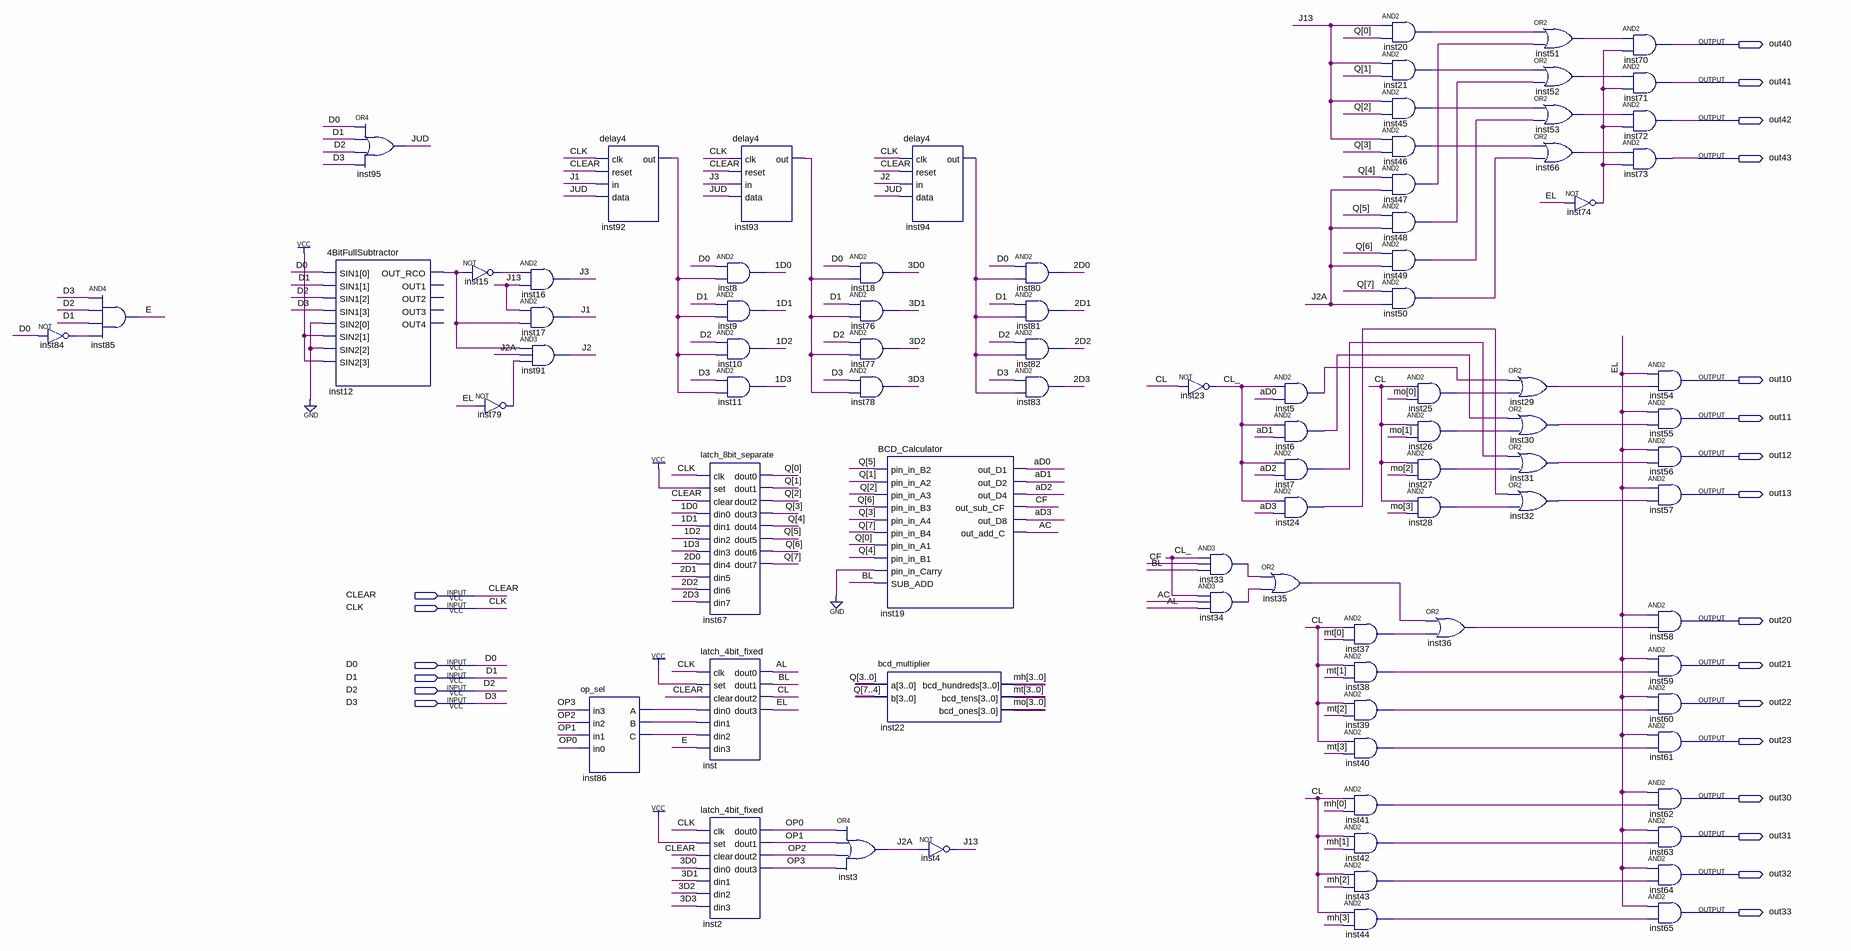
[diagram p0: schematic sheet]
// Quartus schematic Simulation_Circuit2.0.bdf as structural Verilog: 86 symbols, 22 pins
module \Simulation_Circuit2.0  (
  input  CLEAR,
  input  CLK,
  input  D0,
  input  D1,
  input  D2,
  input  D3,
  output out40,
  output out41,
  output out42,
  output out43,
  output out10,
  output out11,
  output out12,
  output out13,
  output out20,
  output out21,
  output out22,
  output out23,
  output out30,
  output out31,
  output out32,
  output out33
);

  wire \1D0 , \1D1 , \1D2 , \1D3 , \2D0 , \2D1 , \2D2 , \2D3 , \3D0 , \3D1 , \3D2 , \3D3 , AC, aD0, aD1, aD2,
       aD3, AL, BL, CF, CL, CL_, E, EL, inst5_out, inst6_out, inst7_out, inst12_out_rco, inst15_out,
       inst20_out, inst21_out, inst24_out, inst25_out, inst26_out, inst27_out, inst28_out, inst29_out,
       inst30_out, inst31_out, inst32_out, inst33_out, inst34_out, inst35_out, inst36_out, inst37_out,
       inst38_out, inst39_out, inst40_out, inst41_out, inst42_out, inst43_out, inst44_out, inst45_out,
       inst46_out, inst47_out, inst48_out, inst49_out, inst50_out, inst51_out, inst52_out, inst53_out,
       inst66_out, inst74_out, inst79_out, inst84_out, inst86_a, inst86_b, inst86_c, inst92_out, inst93_out,
       inst94_out, J1, J2, J2A, J3, J13, JUD, OP0, OP1, OP2, OP3;
  wire [3:0] mh, mo, mt;
  wire [7:0] Q;

  not inst84 (inst84_out, D0);
  and inst85 (E, D3, D2, D1, inst84_out);
  or inst95 (JUD, D0, D1, D2, D3);
  \4BitFullSubtractor  inst12 (
    .SIN1({D3, D2, D1, D0}), .SIN2(4'b1010), .OUT_RCO(inst12_out_rco));  // open: OUT1, OUT2, OUT3, OUT4
  not inst15 (inst15_out, inst12_out_rco);
  not inst79 (inst79_out, EL);
  and inst16 (J3, inst15_out, J13);
  and inst17 (J1, J13, inst12_out_rco);
  and inst91 (J2, inst12_out_rco, J2A, inst79_out);
  delay4 inst92 (.clk(CLK), .reset(CLEAR), .in(J1), .data(JUD), .out(inst92_out));
  op_sel inst86 (.in3(OP3), .in2(OP2), .in1(OP1), .in0(OP0), .A(inst86_a), .B(inst86_b), .C(inst86_c));
  and inst8 (\1D0 , D0, inst92_out);
  and inst9 (\1D1 , D1, inst92_out);
  and inst10 (\1D2 , D2, inst92_out);
  and inst11 (\1D3 , D3, inst92_out);
  latch_8bit_separate inst67 (
    .clk(CLK), .set(1'b1), .clear(CLEAR), .din0(\1D0 ), .din1(\1D1 ), .din2(\1D2 ), .din3(\1D3 ),
    .din4(\2D0 ), .din5(\2D1 ), .din6(\2D2 ), .din7(\2D3 ), .dout0(Q[0]), .dout1(Q[1]), .dout2(Q[2]),
    .dout3(Q[3]), .dout4(Q[4]), .dout5(Q[5]), .dout6(Q[6]), .dout7(Q[7]));
  latch_4bit_fixed inst (
    .clk(CLK), .set(1'b1), .clear(CLEAR), .din0(inst86_a), .din1(inst86_b), .din2(inst86_c), .din3(E),
    .dout0(AL), .dout1(BL), .dout2(CL), .dout3(EL));
  latch_4bit_fixed inst2 (
    .clk(CLK), .set(1'b1), .clear(CLEAR), .din0(\3D0 ), .din1(\3D1 ), .din2(\3D2 ), .din3(\3D3 ),
    .dout0(OP0), .dout1(OP1), .dout2(OP2), .dout3(OP3));
  delay4 inst93 (.clk(CLK), .reset(CLEAR), .in(J3), .data(JUD), .out(inst93_out));
  and inst18 (\3D0 , D0, inst93_out);
  and inst76 (\3D1 , D1, inst93_out);
  and inst77 (\3D2 , D2, inst93_out);
  and inst78 (\3D3 , D3, inst93_out);
  or inst3 (J2A, OP0, OP1, OP2, OP3);
  delay4 inst94 (.clk(CLK), .reset(CLEAR), .in(J2), .data(JUD), .out(inst94_out));
  BCD_Calculator inst19 (
    .pin_in_B2(Q[5]), .pin_in_A2(Q[1]), .pin_in_A3(Q[2]), .pin_in_B3(Q[6]), .pin_in_A4(Q[3]),
    .pin_in_B4(Q[7]), .pin_in_A1(Q[0]), .pin_in_B1(Q[4]), .pin_in_Carry(1'b0), .SUB_ADD(BL), .out_D1(aD0),
    .out_D2(aD1), .out_D4(aD2), .out_sub_CF(CF), .out_D8(aD3), .out_add_C(AC));
  bcd_multiplier inst22 (.a(Q[3:0]), .b(Q[7:4]), .bcd_hundreds(mh), .bcd_tens(mt), .bcd_ones(mo));
  not inst4 (J13, J2A);
  and inst80 (\2D0 , D0, inst94_out);
  and inst81 (\2D1 , D1, inst94_out);
  and inst82 (\2D2 , D2, inst94_out);
  and inst83 (\2D3 , D3, inst94_out);
  not inst23 (CL_, CL);
  and inst33 (inst33_out, CL_, CF, BL);
  and inst34 (inst34_out, CL_, AC, AL);
  and inst5 (inst5_out, CL_, aD0);
  and inst6 (inst6_out, CL_, aD1);
  and inst7 (inst7_out, CL_, aD2);
  and inst24 (inst24_out, CL_, aD3);
  or inst35 (inst35_out, inst33_out, inst34_out);
  and inst37 (inst37_out, CL, mt[0]);
  and inst38 (inst38_out, CL, mt[1]);
  and inst39 (inst39_out, CL, mt[2]);
  and inst40 (inst40_out, CL, mt[3]);
  and inst41 (inst41_out, CL, mh[0]);
  and inst42 (inst42_out, CL, mh[1]);
  and inst43 (inst43_out, CL, mh[2]);
  and inst44 (inst44_out, CL, mh[3]);
  and inst20 (inst20_out, J13, Q[0]);
  and inst21 (inst21_out, J13, Q[1]);
  and inst45 (inst45_out, J13, Q[2]);
  and inst46 (inst46_out, J13, Q[3]);
  and inst47 (inst47_out, Q[4], J2A);
  and inst48 (inst48_out, Q[5], J2A);
  and inst49 (inst49_out, Q[6], J2A);
  and inst50 (inst50_out, Q[7], J2A);
  and inst25 (inst25_out, CL, mo[0]);
  and inst26 (inst26_out, CL, mo[1]);
  and inst27 (inst27_out, CL, mo[2]);
  and inst28 (inst28_out, CL, mo[3]);
  or inst36 (inst36_out, inst35_out, inst37_out);
  or inst29 (inst29_out, inst5_out, inst25_out);
  or inst30 (inst30_out, inst6_out, inst26_out);
  or inst31 (inst31_out, inst7_out, inst27_out);
  or inst32 (inst32_out, inst24_out, inst28_out);
  or inst51 (inst51_out, inst20_out, inst47_out);
  or inst52 (inst52_out, inst21_out, inst48_out);
  or inst53 (inst53_out, inst45_out, inst49_out);
  or inst66 (inst66_out, inst46_out, inst50_out);
  not inst74 (inst74_out, EL);
  and inst70 (out40, inst51_out, inst74_out);
  and inst71 (out41, inst52_out, inst74_out);
  and inst72 (out42, inst53_out, inst74_out);
  and inst73 (out43, inst66_out, inst74_out);
  and inst54 (out10, EL, inst29_out);
  and inst55 (out11, EL, inst30_out);
  and inst56 (out12, EL, inst31_out);
  and inst57 (out13, EL, inst32_out);
  and inst58 (out20, EL, inst36_out);
  and inst59 (out21, EL, inst38_out);
  and inst60 (out22, EL, inst39_out);
  and inst61 (out23, EL, inst40_out);
  and inst62 (out30, EL, inst41_out);
  and inst63 (out31, EL, inst42_out);
  and inst64 (out32, EL, inst43_out);
  and inst65 (out33, EL, inst44_out);
endmodule
